# Altium schematic sheet DebugBoard.SchDoc
size 297 x 209 mm
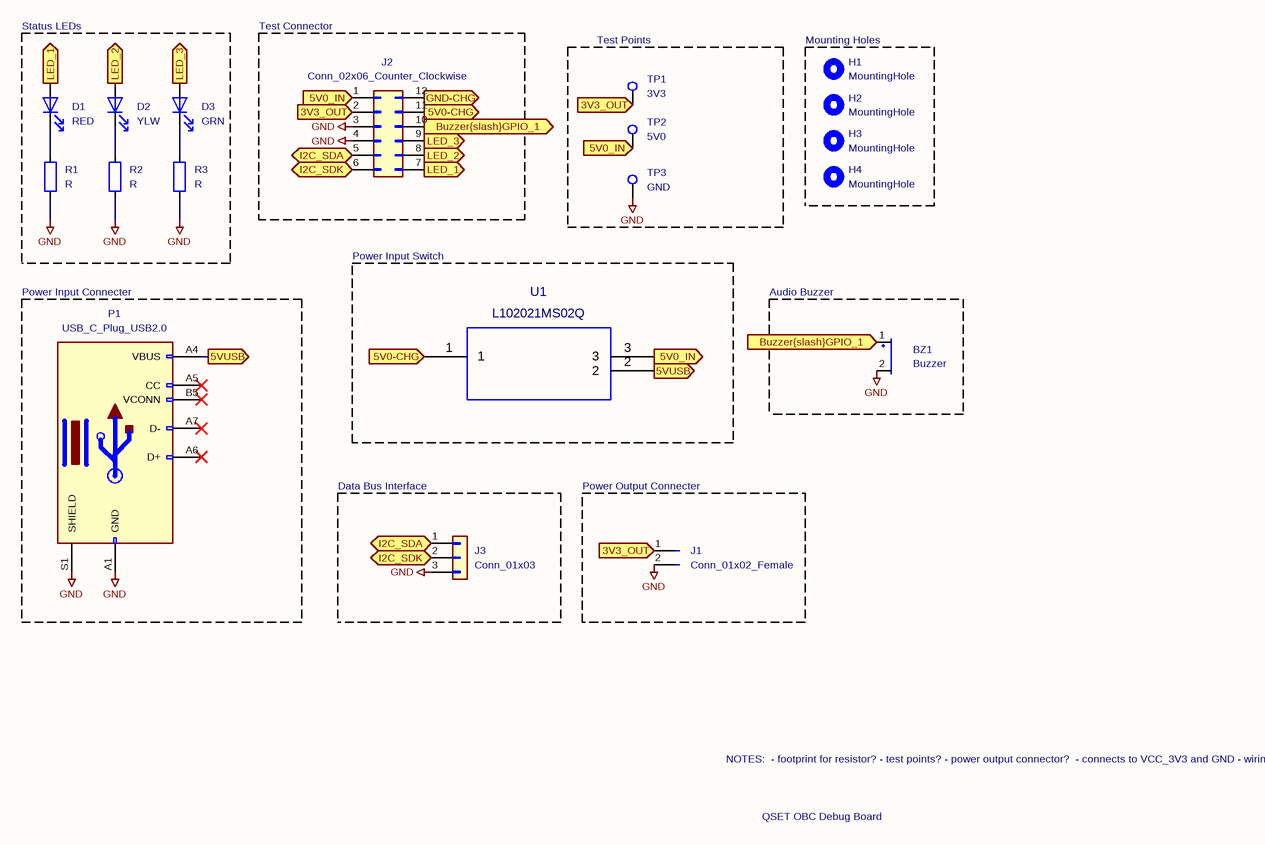
[diagram p0: DebugBoard.SchDoc]

## Parts
BZ1  Buzzer  [XDCR_CMT-8504-100-SMT-TR]
D1  RED  [LED_D3.0mm]
D2  YLW  [LED_D3.0mm]
D3  GRN  [LED_D3.0mm]
H1  MountingHole  [MountingHole_2.2mm_M2_Pad]
H2  MountingHole  [MountingHole_2.2mm_M2_Pad]
H3  MountingHole  [MountingHole_2.2mm_M2_Pad]
H4  MountingHole  [MountingHole_2.2mm_M2_Pad]
J1  Conn_01x02_Female  [PinSocket_1x02_P2.54mm_Horizontal]
J2  Conn_02x06_Counter_Clockwise  [PinHeader_2x06_P2.54mm_Horizontal]
J3  Conn_01x03  [PinHeader_1x03_P2.54mm_Horizontal]
P1  USB_C_Plug_USB2.0  [USB_C_Receptacle_GCT_USB4085]
R1  R  [R_Axial_DIN0207_L6.3mm_D2.5mm_P7.62mm_Horizontal]
R2  R  [R_Axial_DIN0207_L6.3mm_D2.5mm_P7.62mm_Horizontal]
R3  R  [R_Axial_DIN0207_L6.3mm_D2.5mm_P7.62mm_Horizontal]
TP1  3V3  [TestPoint_Pad_2.0x2.0mm]
TP2  5V0  [TestPoint_Pad_2.0x2.0mm]
TP3  GND  [TestPoint_Pad_2.0x2.0mm]
U1  L102021MS02Q  [L102021MS02Q]

## Blocks framed on the sheet
Status LEDs /: D1-D3 R1-R3
Test Connector: J2
Test Points: TP1-TP3
Mounting Holes: H1-H4
Power Input Switch /: U1
Power Input Connecter: P1
Audio Buzzer /: BZ1
Data Bus Interface: J3

## Ports
3V3_OUT (out), 5V0-CHG (in), 5V0_IN (in), 5V0_IN (out), 5VUSB (out), Buzzer{slash}GPIO_1 (in), GND-CHG (in), I2C_SDA (bidir), I2C_SDK (bidir), LED_1 (in), LED_2 (in), LED_3 (in)

## Nets
GND: BZ1.2(+) J1.2(Pin_2) J2.3(Pin_3) J2.4(Pin_4) J3.3(Pin_3) P1.A1(GND) P1.S1(SHIELD) R1.2 R2.2 R3.2 TP3.1
3V3_OUT: J1.1(Pin_1) J2.2(Pin_2) TP1.1 ; port 3V3_OUT
5V0-CHG: J2.11(Pin_11) U1.1 ; port 5V0-CHG
5V0_IN: J2.1(Pin_1) TP2.1 U1.3 ; port 5V0_IN
5VUSB: P1.A4(VBUS) U1.2 ; port 5VUSB
Buzzer{slash}GPIO_1: BZ1.1(-) J2.10(Pin_10) ; port Buzzer{slash}GPIO_1
GND-CHG: J2.12(Pin_12) ; port GND-CHG
I2C_SDA: J2.5(Pin_5) J3.1(Pin_1) ; port I2C_SDA
I2C_SDK: J2.6(Pin_6) J3.2(Pin_2) ; port I2C_SDK
LED_1: D1.2(A) J2.7(Pin_7) ; port LED_1
LED_2: D2.2(A) J2.8(Pin_8) ; port LED_2
LED_3: D3.2(A) J2.9(Pin_9) ; port LED_3
NetD1_1: D1.1(K) R1.1
NetD2_1: D2.1(K) R2.1
NetD3_1: D3.1(K) R3.1

Not connected (* = marked no-connect by the designer): P1 A5(CC)* A6(D+)* A7(D-)* A9(VBUS) A12(GND) B1(GND) B4(VBUS) B5(VCONN)* B9(VBUS) B12(GND)

## Notes on the sheet
- Power Output Connecter
- NOTES:
  - footprint for resistor?
  - test points?
  - power output connector?
  - connects to VCC_3V3 and GND
  - wiring of the usb-c for power?
  - wiring everything else?
- QSET OBC Debug Board
- 1
- 2
- 3
- 4
- 5
- 6
- A
- B
- C
- D
- Title:
- File: DebugBoard.kicad_sch
- Sheet: /
- KiCad E.D.A.  kicad (5.1.4)-1
- Size: A4
- Date:
- Rev:
- Id: 1/1

## Library data of the parts
D1-D3 = LED: Footprint: LED_THT:LED_D3.0mm
  D1: Value: RED
  D2: Value: YLW
  D3: Value: GRN
TP1-TP3 = TestPoint: Footprint: TestPoint:TestPoint_Pad_2.0x2.0mm
  TP1: Value: 3V3
  TP2: Value: 5V0
  TP3: Value: GND
BZ1 = Buzzer: Value: Buzzer; Footprint: Daughterboard_footprints:XDCR_CMT-8504-100-SMT-TR
H1-H4 = MountingHole: Value: MountingHole; Footprint: MountingHole:MountingHole_2.2mm_M2_Pad
J1 = Conn_01x02_Female: Value: Conn_01x02_Female; Footprint: Connector_PinSocket_2.54mm:PinSocket_1x02_P2.54mm_Horizontal
J2 = Conn_02x06_Counter_Clockwise: Value: Conn_02x06_Counter_Clockwise; Footprint: Connector_PinHeader_2.54mm:PinHeader_2x06_P2.54mm_Horizontal
J3 = Conn_01x03: Value: Conn_01x03; Footprint: Connector_PinHeader_2.54mm:PinHeader_1x03_P2.54mm_Horizontal
P1 = USB_C_Plug_USB2.0: Value: USB_C_Plug_USB2.0; Footprint: Connector_USB:USB_C_Receptacle_GCT_USB4085
R1-R3 = R: Value: R; Footprint: Resistor_THT:R_Axial_DIN0207_L6.3mm_D2.5mm_P7.62mm_Horizontal
U1 = L102021MS02Q: Value: L102021MS02Q; Footprint: qset-footprints:L102021MS02Q